# Altium schematic sheet STM32.SchDoc
size A3
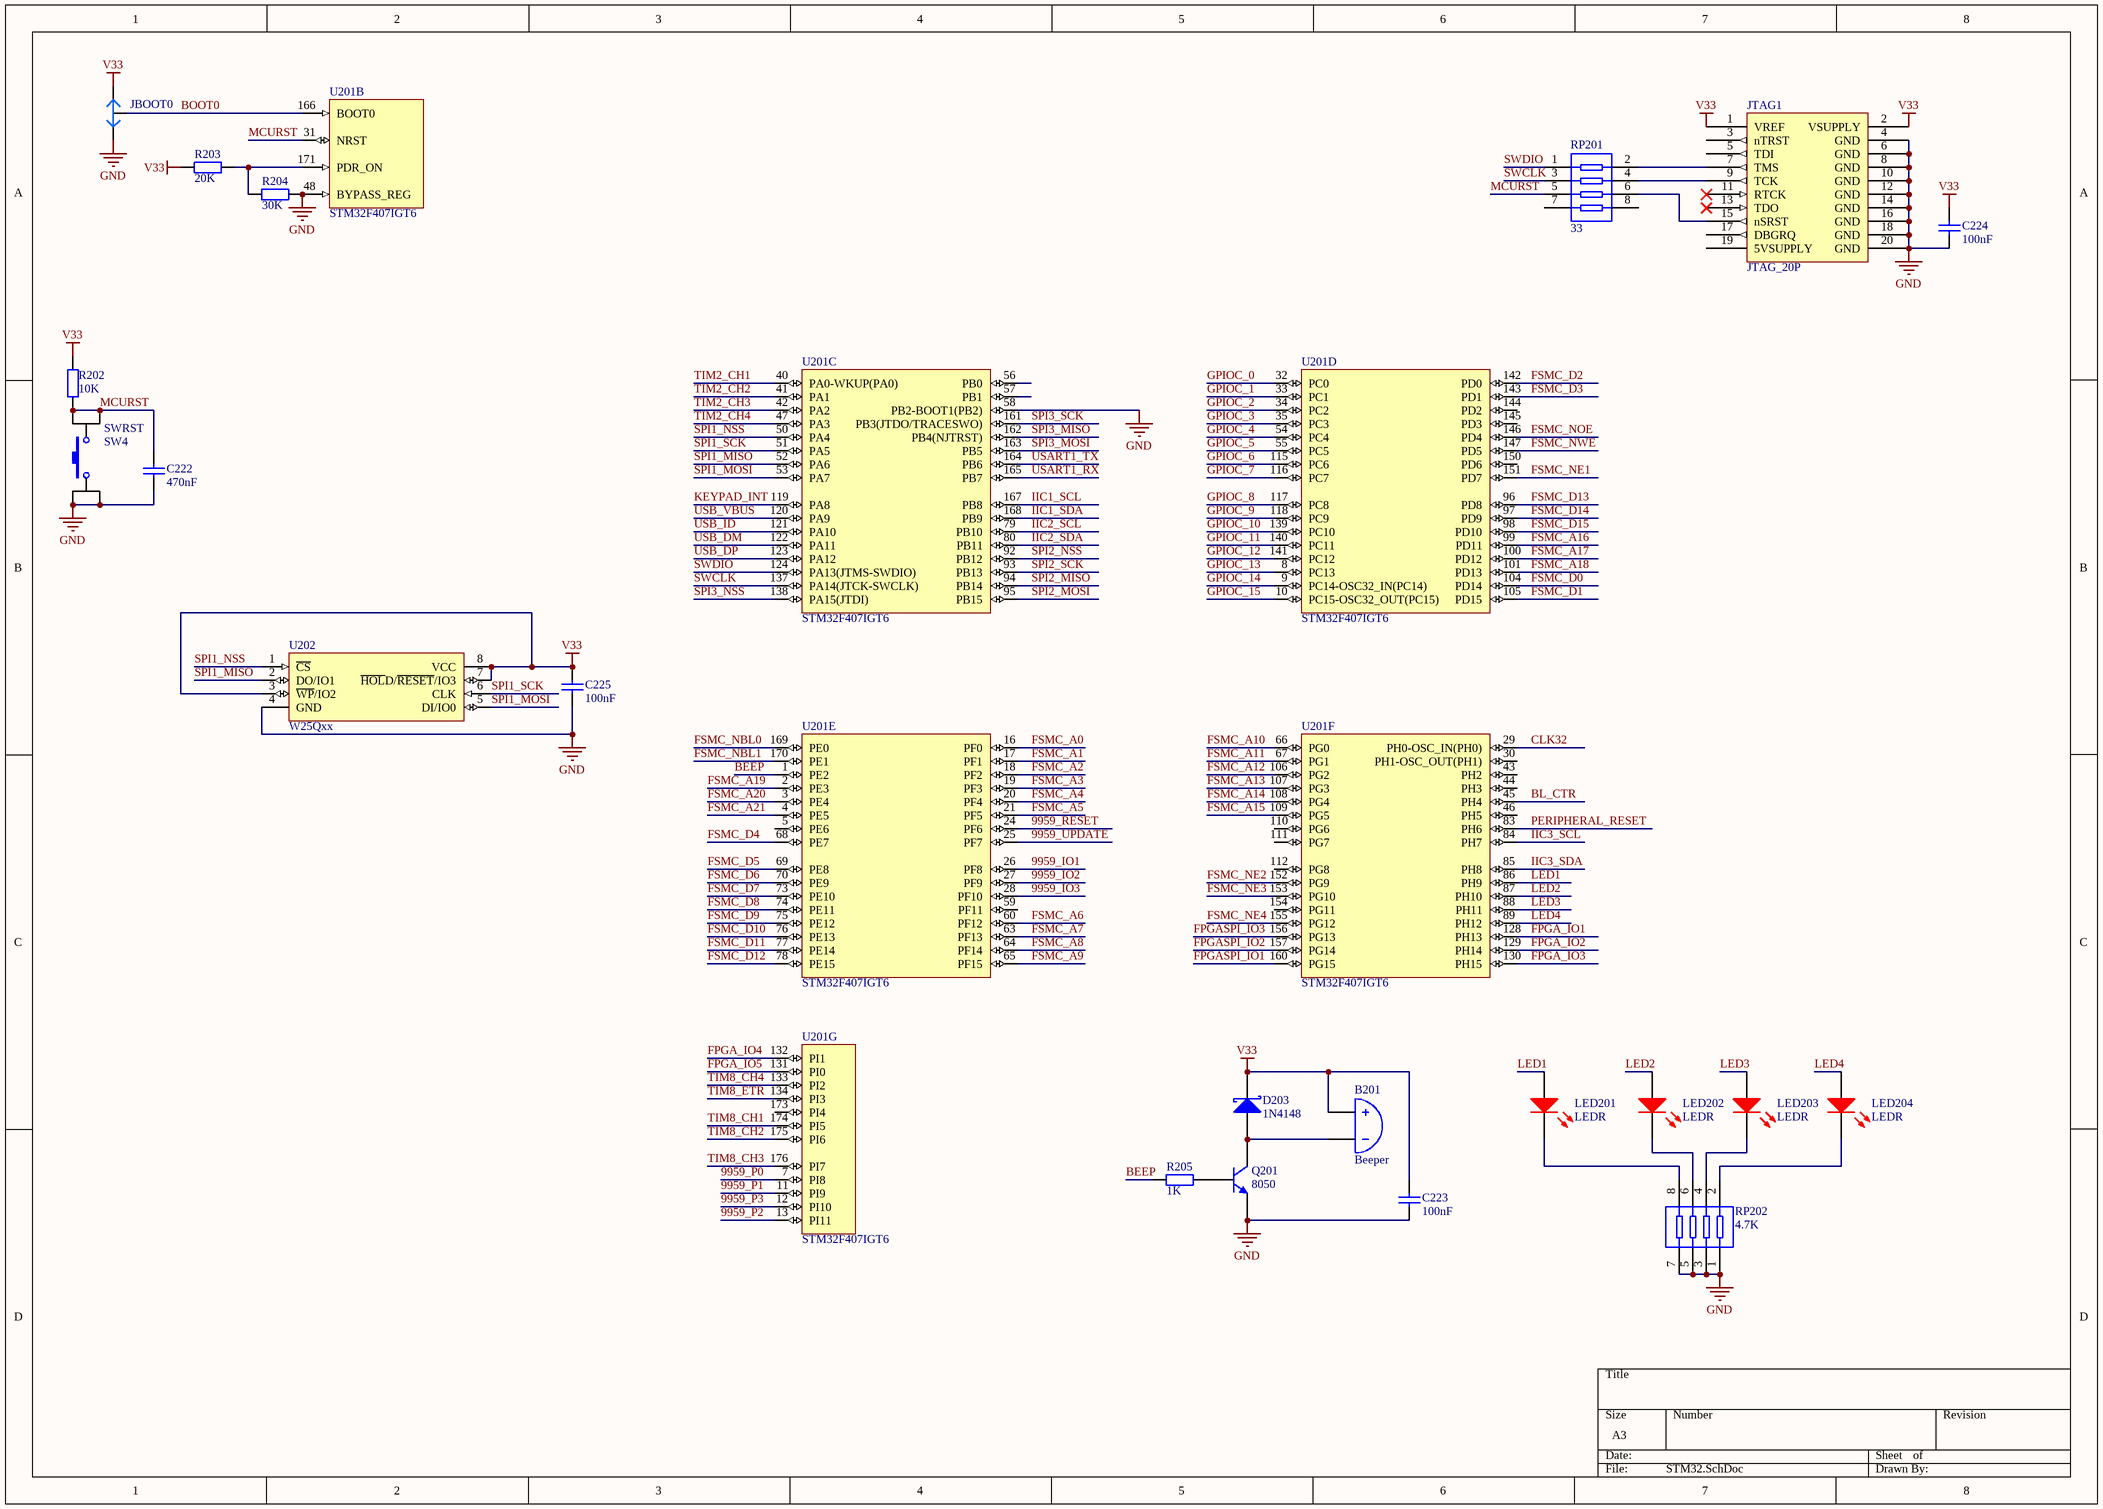
[diagram p0: STM32.SchDoc]

## Parts
B201  Beeper  [BEEPER]
C222  value 470nF  [0603C]  (hidden comment: MLCC)
C223  value 100nF  [0603C]  (hidden comment: MLCC)
C224  value 100nF  [0805C]  (hidden comment: MLCC)
C225  value 100nF  [0603C]  (hidden comment: MLCC)
D203  1N4148  [SOD323]
JBOOT0  Switch_2Ch_Line  [SWITCH_2CH_LINE]  (value not drawn)
JTAG1  JTAG_20P  [JTAG20]
LED201  LEDR  [LED1206R]
LED202  LEDR  [LED1206R]
LED203  LEDR  [LED1206R]
LED204  LEDR  [LED1206R]
Q201  8050  [SOT-23]
R202  value 10K  [0603R]  (hidden comment: Resistor)
R203  value 20K  [0603R]  (hidden comment: Resistor)
R204  value 30K  [0603R]  (hidden comment: Resistor)
R205  value 1K  [0603R]  (hidden comment: Resistor)
RP201  value 33  [8P4R_0603]  (hidden comment: Res Pack)
RP202  value 4.7K  [8P4R_0603]  (hidden comment: Res Pack)
SWRST  SW4  [SW-0606]
U201  STM32F407IGT6  [STM-LQFP176_N]  (parts B,C,D,E,F,G of 7)
U202  W25Qxx  [W25Qxx]

## Nets
GND: C222.1 C223.1 C224.1 C225.1 JBOOT0.3 JTAG1.4(GND) JTAG1.6(GND) JTAG1.8(GND) JTAG1.10(GND) JTAG1.12(GND) JTAG1.14(GND) JTAG1.16(GND) JTAG1.18(GND) JTAG1.20(GND) Q201.2(E) R204.2 RP202.1 RP202.3 RP202.5 RP202.7 SWRST.2 SWRST.4 U201.48(BYPASS_REG) U201.58(PB2-BOOT1(PB2)) U202.4(GND)
V33: B201.1(A) C223.2 C224.2 C225.2 D203.2(K) JBOOT0.2 JTAG1.1(VREF) JTAG1.2(VSUPPLY) R202.2 R203.1 U202.3(~{WP}/IO2) U202.7(~{HOL}D/~{RESET}/IO3) U202.8(VCC)
9959_IO1: U201.26(PF8)
9959_IO2: U201.27(PF9)
9959_IO3: U201.28(PF10)
9959_P0: U201.7(PI8)
9959_P1: U201.11(PI9)
9959_P2: U201.13(PI11)
9959_P3: U201.12(PI10)
9959_RESET: U201.24(PF6)
9959_UPDATE: U201.25(PF7)
BEEP: R205.1 U201.1(PE2)
BL_CTR: U201.45(PH4)
BOOT0: JBOOT0.1 U201.166(BOOT0)
CLK32: U201.29(PH0-OSC_IN(PH0))
FPGA_IO1: U201.128(PH13)
FPGA_IO2: U201.129(PH14)
FPGA_IO3: U201.130(PH15)
FPGA_IO4: U201.132(PI1)
FPGA_IO5: U201.131(PI0)
FPGASPI_IO1: U201.160(PG15)
FPGASPI_IO2: U201.157(PG14)
FPGASPI_IO3: U201.156(PG13)
FSMC_A0: U201.16(PF0)
FSMC_A1: U201.17(PF1)
FSMC_A2: U201.18(PF2)
FSMC_A3: U201.19(PF3)
FSMC_A4: U201.20(PF4)
FSMC_A5: U201.21(PF5)
FSMC_A6: U201.60(PF12)
FSMC_A7: U201.63(PF13)
FSMC_A8: U201.64(PF14)
FSMC_A9: U201.65(PF15)
FSMC_A10: U201.66(PG0)
FSMC_A11: U201.67(PG1)
FSMC_A12: U201.106(PG2)
FSMC_A13: U201.107(PG3)
FSMC_A14: U201.108(PG4)
FSMC_A15: U201.109(PG5)
FSMC_A16: U201.99(PD11)
FSMC_A17: U201.100(PD12)
FSMC_A18: U201.101(PD13)
FSMC_A19: U201.2(PE3)
FSMC_A20: U201.3(PE4)
FSMC_A21: U201.4(PE5)
FSMC_D0: U201.104(PD14)
FSMC_D1: U201.105(PD15)
FSMC_D2: U201.142(PD0)
FSMC_D3: U201.143(PD1)
FSMC_D4: U201.68(PE7)
FSMC_D5: U201.69(PE8)
FSMC_D6: U201.70(PE9)
FSMC_D7: U201.73(PE10)
FSMC_D8: U201.74(PE11)
FSMC_D9: U201.75(PE12)
FSMC_D10: U201.76(PE13)
FSMC_D11: U201.77(PE14)
FSMC_D12: U201.78(PE15)
FSMC_D13: U201.96(PD8)
FSMC_D14: U201.97(PD9)
FSMC_D15: U201.98(PD10)
FSMC_NBL0: U201.169(PE0)
FSMC_NBL1: U201.170(PE1)
FSMC_NE1: U201.151(PD7)
FSMC_NE2: U201.152(PG9)
FSMC_NE3: U201.153(PG10)
FSMC_NE4: U201.155(PG12)
FSMC_NOE: U201.146(PD4)
FSMC_NWE: U201.147(PD5)
GPIOC_0: U201.32(PC0)
GPIOC_1: U201.33(PC1)
GPIOC_2: U201.34(PC2)
GPIOC_3: U201.35(PC3)
GPIOC_4: U201.54(PC4)
GPIOC_5: U201.55(PC5)
GPIOC_6: U201.115(PC6)
GPIOC_7: U201.116(PC7)
GPIOC_8: U201.117(PC8)
GPIOC_9: U201.118(PC9)
GPIOC_10: U201.139(PC10)
GPIOC_11: U201.140(PC11)
GPIOC_12: U201.141(PC12)
GPIOC_13: U201.8(PC13)
GPIOC_14: U201.9(PC14-OSC32_IN(PC14))
GPIOC_15: U201.10(PC15-OSC32_OUT(PC15))
IIC1_SCL: U201.167(PB8)
IIC1_SDA: U201.168(PB9)
IIC2_SCL: U201.79(PB10)
IIC2_SDA: U201.80(PB11)
IIC3_SCL: U201.84(PH7)
IIC3_SDA: U201.85(PH8)
KEYPAD_INT: U201.119(PA8)
LED1: LED201.1(A) U201.86(PH9)
LED2: LED202.1(A) U201.87(PH10)
LED3: LED203.1(A) U201.88(PH11)
LED4: LED204.1(A) U201.89(PH12)
MCURST: C222.2 R202.1 RP201.5 SWRST.1 SWRST.3 U201.31(NRST)
PERIPHERAL_RESET: U201.83(PH6)
SPI1_MISO: U201.52(PA6) U202.2(DO/IO1)
SPI1_MOSI: U201.53(PA7) U202.5(DI/IO0)
SPI1_NSS: U201.50(PA4) U202.1(~{CS})
SPI1_SCK: U201.51(PA5) U202.6(CLK)
SPI2_MISO: U201.94(PB14)
SPI2_MOSI: U201.95(PB15)
SPI2_NSS: U201.92(PB12)
SPI2_SCK: U201.93(PB13)
SPI3_MISO: U201.162(PB4(NJTRST))
SPI3_MOSI: U201.163(PB5)
SPI3_NSS: U201.138(PA15(JTDI))
SPI3_SCK: U201.161(PB3(JTDO/TRACESWO))
SWCLK: RP201.3 U201.137(PA14(JTCK-SWCLK))
SWDIO: RP201.1 U201.124(PA13(JTMS-SWDIO))
TIM2_CH1: U201.40(PA0-WKUP(PA0))
TIM2_CH2: U201.41(PA1)
TIM2_CH3: U201.42(PA2)
TIM2_CH4: U201.47(PA3)
TIM8_CH1: U201.174(PI5)
TIM8_CH2: U201.175(PI6)
TIM8_CH3: U201.176(PI7)
TIM8_CH4: U201.133(PI2)
TIM8_ETR: U201.134(PI3)
USART1_RX: U201.165(PB7)
USART1_TX: U201.164(PB6)
USB_DM: U201.122(PA11)
USB_DP: U201.123(PA12)
USB_ID: U201.121(PA10)
USB_VBUS: U201.120(PA9)
NetB201_2: B201.2(B) D203.1(A) Q201.3(C)
NetJTAG1_7: JTAG1.7(TMS) RP201.2
NetJTAG1_9: JTAG1.9(TCK) RP201.4
NetJTAG1_15: JTAG1.15(nSRST) RP201.6
NetLED201_2: LED201.2(K) RP202.8
NetLED202_2: LED202.2(K) RP202.6
NetLED203_2: LED203.2(K) RP202.4
NetLED204_2: LED204.2(K) RP202.2
NetQ201_1: Q201.1(B) R205.2
NetR203_2: R203.2 R204.1 U201.171(PDR_ON)

Not connected (* = marked no-connect by the designer): JTAG1 3(nTRST) 5(TDI) 11(RTCK)* 13(TDO)* 17(DBGRQ) 19(5VSUPPLY); RP201 7 8; U201 5(PE6) 30(PH1-OSC_OUT(PH1)) 43(PH2) 44(PH3) 46(PH5) 56(PB0) 57(PB1) 59(PF11) 110(PG6) 111(PG7) 112(PG8) 144(PD2) 145(PD3) 150(PD6) 154(PG11) 173(PI4)

## Library data of the parts
D203 = 1N4148: Small signal didoe
JTAG1 = JTAG_20P: 20 pin JTAG port
LED201-LED204 = LEDR: RED LED
Q201 = 8050: NPN Bipolar Transistor
RP201 RP202 = Res Pack: Isolated Resistor Network
SWRST = SW4: Switch
U201 = STM32F407IGT6: ARM Cortex-M4 32-bit MCU+FPU, 210 DMIPS, 1024 kB Flash, 192 kB Internal RAM, 140 I/Os, 176-pin LQFP, -40 to 85 degC, Tray; Manufacturer: STMicroelectronics; D/A Converter: 2x12-bit; FLASH Size (Prog) (kB): 1024; I/Os (High Current): 140; Internal RAM Size (kB): 192; Operating Frequency(F) (Processor speed) (MHz): 168; Supply Voltage(Vcc) max (V): 3.6; Supply Voltage(Vcc) min (V): 1.8; DatasheetVersion: Rev. 4; PackageVersion: Rev. 4, 06/2013; PackageReference: LQFP176; PackageDescription: 176-Pin Low Profile Quad Flat Package, 24 x 24 mm Body, 0.5 mm Pitch; Supplier 1: Digi-Key; Supplier Part Number 1: 497-11604-ND; Supplier 2: Farnell; Supplier Part Number 2: 2064366; Supplier 3: Newark; Supplier Part Number 3: 73T2331; Supplier 4: Mouser; Supplier Part Number 4: 511-STM32F407IGT6; Core: ARM Cortex-M4; Packing: Tray; Mounting Technology: Surface Mount; PartNumber: STM32F407IGT6; ComponentLink1Description: Manufacturer URL; ComponentLink1URL: http://www.st.com/web/en/home.html; ComponentLink2Description: Datasheet; ComponentLink2URL: http://www.st.com/st-web-ui/static/active/en/resource/technical/document/datasheet/DM00037051.pdf; ComponentLink3Description: Package Specification; ComponentLink3URL: http://www.st.com/st-web-ui/static/active/en/resource/technical/document/datasheet/DM00035129.pdf
U202 = W25Qxx: 3V SERIAL FLASH MEMORY WITH DUAL/QUAD SPI & QPI